# Altium schematic sheet pca63100_current_measurement.SchDoc: Power Profiler Kit II
size A3; Organization: Nordic Semiconductor; Revision: 1.0.1; SheetNumber: 4; SheetTotal: 6; CompanyName: Nordic Semiconductor; DocumentSize: A3
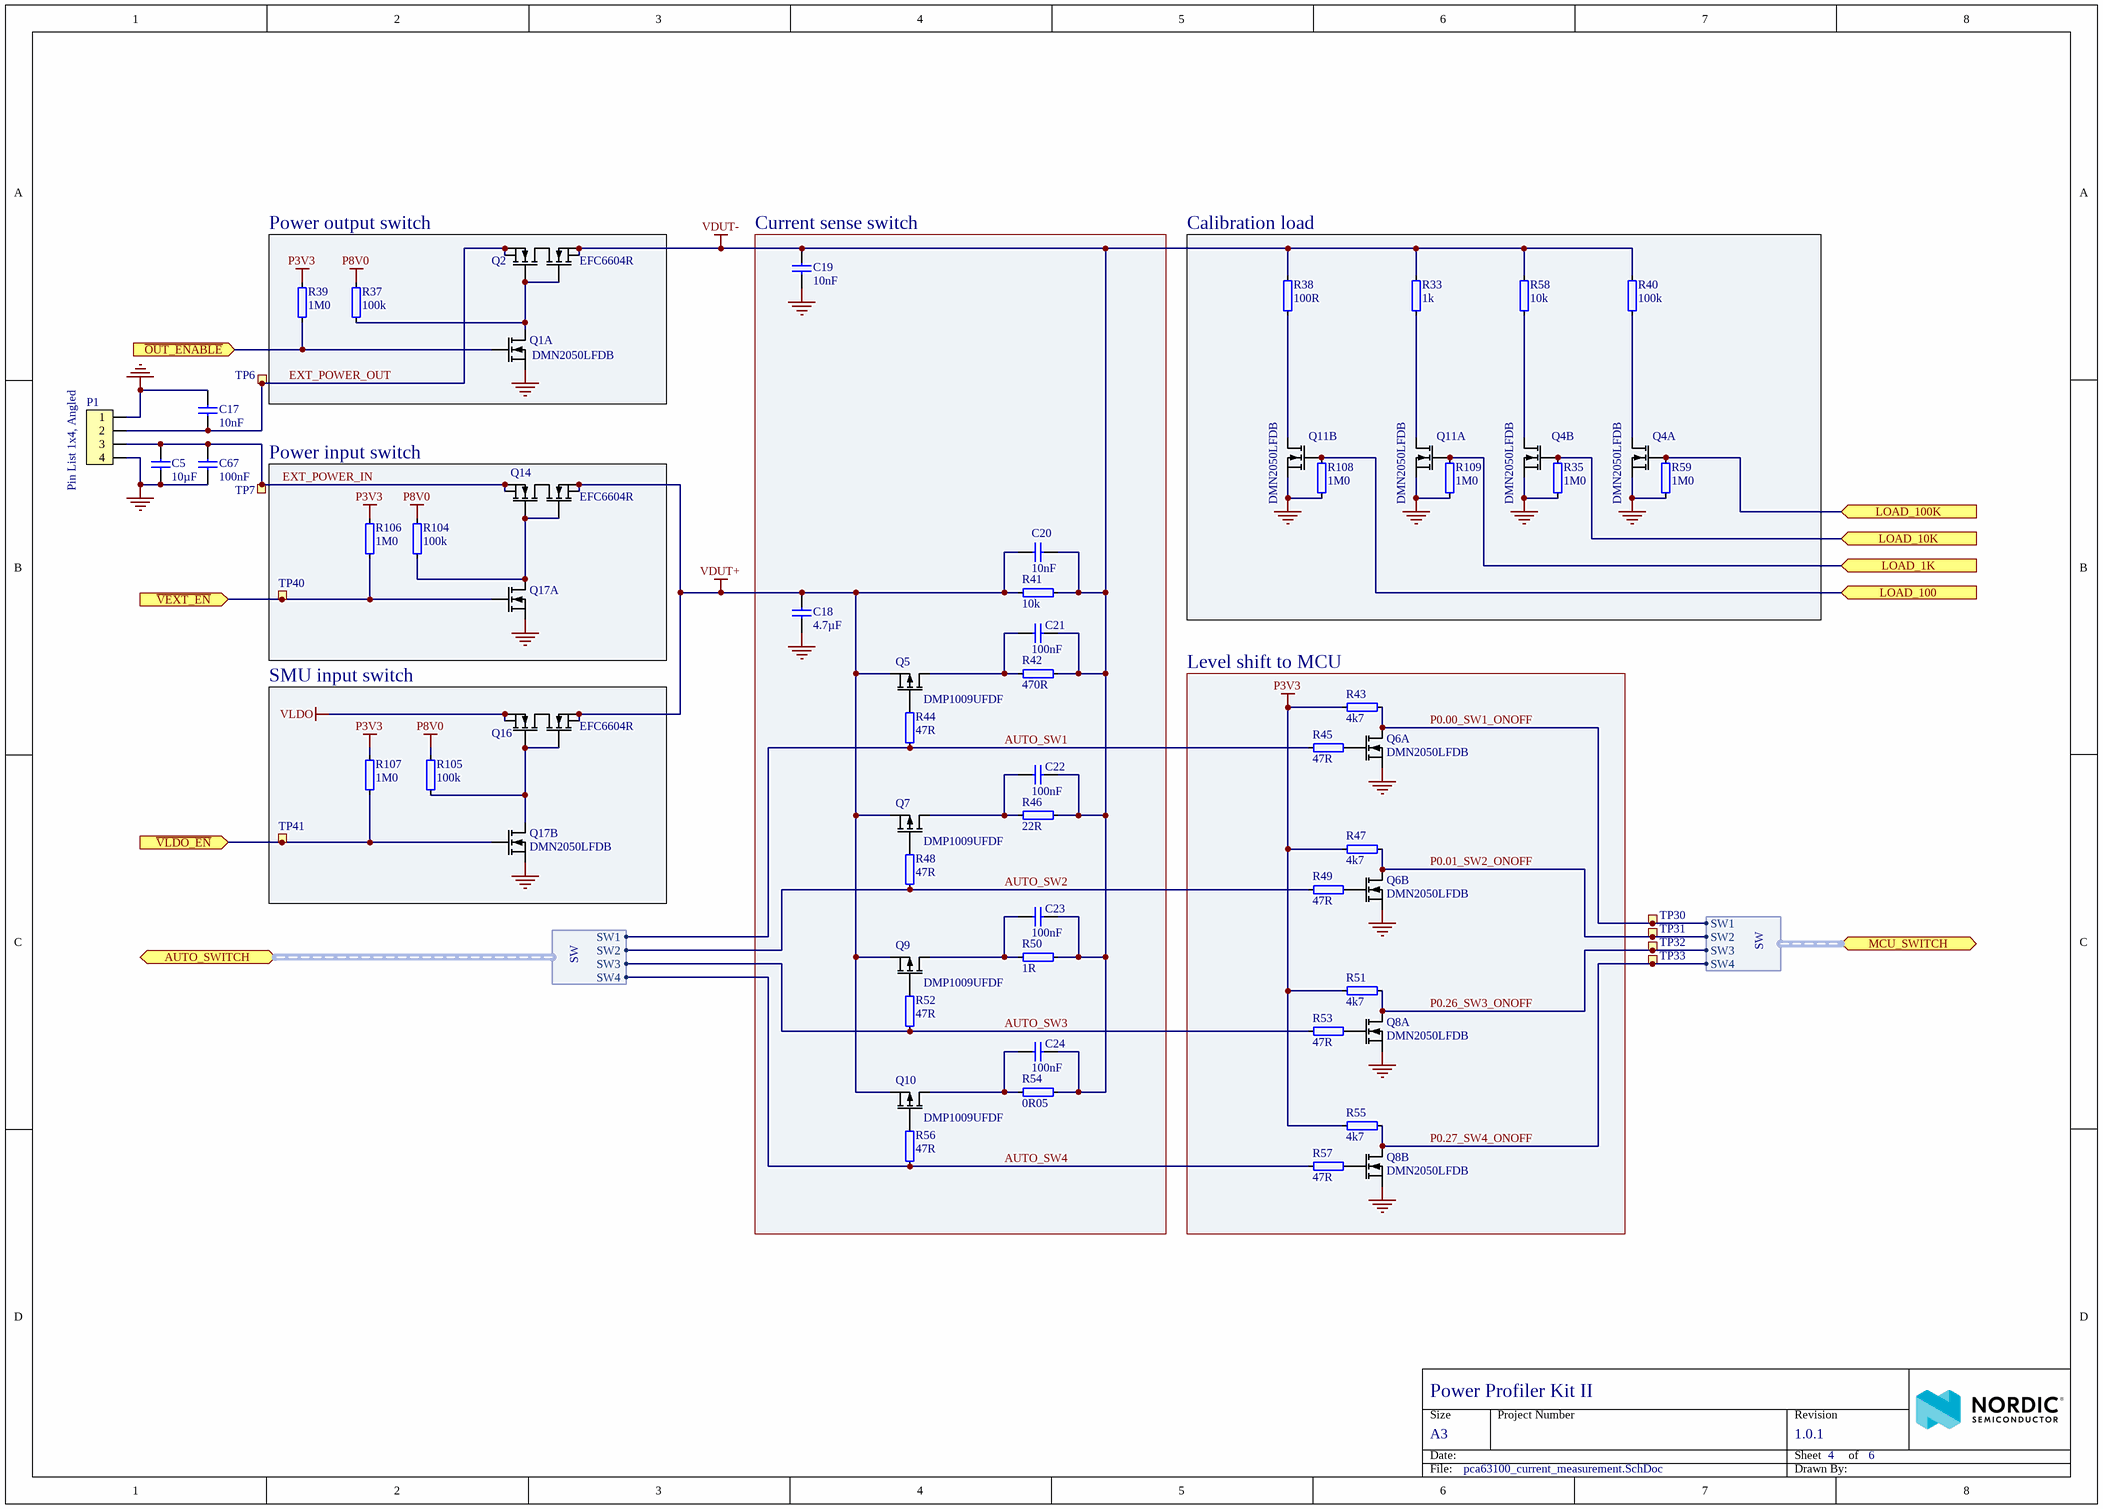
[diagram p0: pca63100_current_measurement.SchDoc]

## Parts
C5  10µF  [CAPC1608X06L]
C17  10nF  [CAPC0603X03L_C]
C18  4.7µF  [CAPC1005X04L]
C19  10nF  [CAPC0603X03L_C]
C20  10nF  [CAPC0603X03L_C]
C21  100nF  [CAPC0603X03L_C]
C22  100nF  [CAPC0603X03L_C]
C23  100nF  [CAPC0603X03L_C]
C24  100nF  [CAPC0603X03L_C]
C67  100nF  [CAPC0603X03L_C]
P1  Pin List 1x4, Angled  [LIST_ANG_1x4-SMD-2.54MM]
Q1  DMN2050LFDB  [DFN65P200X60_HS-6N]  (part A of 2)
Q2  EFC6604R  [BGA6C65P2X3_146X191X22]
Q4  DMN2050LFDB  [DFN65P200X60_HS-6N]  (parts A,B of 2)
Q5  DMP1009UFDF  [UDFN65P200X200X60_HS-6N]
Q6  DMN2050LFDB  [DFN65P200X60_HS-6N]  (parts A,B of 2)
Q7  DMP1009UFDF  [UDFN65P200X200X60_HS-6N]
Q8  DMN2050LFDB  [DFN65P200X60_HS-6N]  (parts A,B of 2)
Q9  DMP1009UFDF  [UDFN65P200X200X60_HS-6N]
Q10  DMP1009UFDF  [UDFN65P200X200X60_HS-6N]
Q11  DMN2050LFDB  [DFN65P200X60_HS-6N]  (parts A,B of 2)
Q14  EFC6604R  [BGA6C65P2X3_146X191X22]
Q16  EFC6604R  [BGA6C65P2X3_146X191X22]
Q17  DMN2050LFDB  [DFN65P200X60_HS-6N]  (value not drawn)  (parts A,B of 2)
R33  1k  [RESC1005X04L]
R35  1M0  [RESC0603X03L_C]
R37  100k  [RESC0603X03L_C]
R38  100R  [RESC2012X11L]
R39  1M0  [RESC0603X03L_C]
R40  100k  [RESC1005X04L]
R41  10k  [RESC1005X04L]
R42  470R  [RESC1005X04L]
R43  4k7  [RESC0603X03L_C]
R44  47R  [RESC0603X03L_C]
R45  47R  [RESC0603X03L_C]
R46  22R  [RESC1005X04L]
R47  4k7  [RESC0603X03L_C]
R48  47R  [RESC0603X03L_C]
R49  47R  [RESC0603X03L_C]
R50  1R  [RESC1005X04L]
R51  4k7  [RESC0603X03L_C]
R52  47R  [RESC0603X03L_C]
R53  47R  [RESC0603X03L_C]
R54  0R05  [RESC1005X04L]
R55  4k7  [RESC0603X03L_C]
R56  47R  [RESC0603X03L_C]
R57  47R  [RESC0603X03L_C]
R58  10k  [RESC0603X03L_C]
R59  1M0  [RESC0603X03L_C]
R104  100k  [RESC0603X03L_C]
R105  100k  [RESC0603X03L_C]
R106  1M0  [RESC0603X03L_C]
R107  1M0  [RESC0603X03L_C]
R108  1M0  [RESC0603X03L_C]
R109  1M0  [RESC0603X03L_C]
TP6  Ø1.5mm,SMD  [TP_SMD_Ø1.5mm]  (value not drawn)  (no BOM)
TP7  Ø1.5mm,SMD  [TP_SMD_Ø1.5mm]  (value not drawn)  (no BOM)
TP30  Ø0.7mm,SMD  [TP_SMD_Ø0.7mm]  (value not drawn)  (no BOM)
TP31  Ø0.7mm,SMD  [TP_SMD_Ø0.7mm]  (value not drawn)  (no BOM)
TP32  Ø0.7mm,SMD  [TP_SMD_Ø0.7mm]  (value not drawn)  (no BOM)
TP33  Ø0.7mm,SMD  [TP_SMD_Ø0.7mm]  (value not drawn)  (no BOM)
TP40  Ø0.7mm,SMD  [TP_SMD_Ø0.7mm]  (value not drawn)  (no BOM)
TP41  Ø0.7mm,SMD  [TP_SMD_Ø0.7mm]  (value not drawn)  (no BOM)

## Blocks framed on the sheet
Power output switch: Q1 Q2 R37 R39
Current sense switch: C18-C24 Q5 Q7 Q9 Q10 R41 R42 R44 R46 R48 R50 R52 R54 R56
Calibration load: Q4 Q11 R33 R35 R38 R40 R58 R59 R108 R109
Power input switch: Q14 Q17 R104 R106 TP40
SMU input switch: Q16 Q17 R105 R107 TP41
Level shift to MCU: Q6 Q8 R43 R45 R47 R49 R51 R53 R55 R57

## Ports
AUTO_SWITCH (bidir, harness SW), LOAD_1K (in), LOAD_10K (in), LOAD_100 (in), LOAD_100K (in), MCU_SWITCH (bidir, harness SW), ~{OUT_ENABLE} (in), ~{VEXT_EN} (in), ~{VLDO_EN} (in)

## Harnesses
SW: SW1, SW2, SW3, SW4

## Nets
GND: C5.2 C17.1 C18.2 C19.1 C67.2 P1.1 P1.4 Q1.1(S1) Q4.1(S1) Q4.4(S2) Q6.1(S1) Q6.4(S2) Q8.1(S1) Q8.4(S2) Q11.1(S1) Q11.4(S2) Q17.1(S1) Q17.4(S2) R35.1 R59.1 R108.1 R109.1
P3V3: R39.2 R43.2 R47.2 R51.2 R55.2 R106.2 R107.2
P8V0: R37.1 R104.2 R105.2
VDUT+: C18.1 C20.1 Q5.2(S) Q7.2(S) Q9.2(S) Q10.2(S) Q14.1(S1) Q14.3(S2) Q16.1(S1) Q16.3(S2) R41.1
VDUT-: C19.2 C20.2 C21.2 C22.2 C23.2 C24.2 Q2.1(S1) Q2.3(S2) R33.1 R38.2 R40.2 R41.2 R42.2 R46.2 R50.2 R54.1 R58.1
VLDO: Q16.4(S2) Q16.6(S2)
AUTO_SW1: R44.1 R45.2 ; port AUTO_SWITCH.SW1
AUTO_SW2: R48.1 R49.2 ; port AUTO_SWITCH.SW2
AUTO_SW3: R52.1 R53.2 ; port AUTO_SWITCH.SW3
AUTO_SW4: R56.1 R57.2 ; port AUTO_SWITCH.SW4
EXT_POWER_IN: C5.1 C67.1 P1.3 Q14.4(S2) Q14.6(S2) TP7.1
EXT_POWER_OUT: C17.2 P1.2 Q2.4(S2) Q2.6(S2) TP6.1
LOAD_1K: Q11.2(G1) R109.2 ; port LOAD_1K
LOAD_10K: Q4.5(G2) R35.2 ; port LOAD_10K
LOAD_100: Q11.5(G2) R108.2 ; port LOAD_100
LOAD_100K: Q4.2(G1) R59.2 ; port LOAD_100K
~{OUT_ENABLE}: Q1.2(G1) R39.1 ; port ~{OUT_ENABLE}
P0.00_SW1_ONOFF: Q6.6(D1) R43.1 TP30.1 ; port MCU_SWITCH.SW1
P0.01_SW2_ONOFF: Q6.3(D2) R47.1 TP31.1 ; port MCU_SWITCH.SW2
P0.26_SW3_ONOFF: Q8.6(D1) R51.1 TP32.1 ; port MCU_SWITCH.SW3
P0.27_SW4_ONOFF: Q8.3(D2) R55.1 TP33.1 ; port MCU_SWITCH.SW4
~{VEXT_EN}: Q17.2(G1) R106.1 TP40.1 ; port ~{VEXT_EN}
~{VLDO_EN}: Q17.5(G2) R107.1 TP41.1 ; port ~{VLDO_EN}
NetC21_1: C21.1 Q5.3(D) R42.1
NetC22_1: C22.1 Q7.3(D) R46.1
NetC23_1: C23.1 Q9.3(D) R50.1
NetC24_1: C24.1 Q10.3(D) R54.2
NetQ1_6: Q1.6(D1) Q2.2(G1) Q2.5(G2) R37.2
NetQ4_3: Q4.3(D2) R58.2
NetQ4_6: Q4.6(D1) R40.1
NetQ5_1: Q5.1(G) R44.2
NetQ6_2: Q6.2(G1) R45.1
NetQ6_5: Q6.5(G2) R49.1
NetQ7_1: Q7.1(G) R48.2
NetQ8_2: Q8.2(G1) R53.1
NetQ8_5: Q8.5(G2) R57.1
NetQ9_1: Q9.1(G) R52.2
NetQ10_1: Q10.1(G) R56.2
NetQ11_3: Q11.3(D2) R38.1
NetQ11_6: Q11.6(D1) R33.2
NetQ14_2: Q14.2(G1) Q14.5(G2) Q17.6(D1) R104.1
NetQ16_2: Q16.2(G1) Q16.5(G2) Q17.3(D2) R105.1

## Notes on the sheet
- Size
- Date:
- A3
- Project Number
- Sheet         of
- Revision
- File:
- Drawn By:

## Library data of the parts
C5 = 0603-10u-10V-X7T-GRM188: CAP CER 10UF 10V X7T 0603; Manufacturer: Murata; Manufacturer Part Number: GRM188D71A106MA73; Part number IPS: 00000004696; Note: 10VDC; Artikkelnr Noca: N.A; Pad Count: 2; Part Number: 0603-10u-10V-X7T-GRM188; ComponentLink1Description: Datasheet; ComponentLink2Description: Supplier link; HelpURL: https://no.mouser.com/datasheet/2/281/murata_03052018_GRM_Series_1-1310166.pdf; Footprint Doc: 0603; LatestRevisionDate: 2020-10-13; Pin Count: 2; Publisher: Nordic Semiconductor; Published: 2018-09-11; Value: 10µF; Supplier 1: Digi-Key; Supplier Part Number 1: 490-7200-1-ND; Supplier 2: Mouser; Supplier Part Number 2: 81-GRM188D71A106MA3D; Component Class: Capacitors; PartId: 100200414
C17 C19 C20 = C0201-10n: Capacitor, X7R, ±10%; Part number IPS: 00000003480; Note: 10V; Artikkelnr Noca: N.A.; Pad Count: 2; Part Number: C0201-10n; LatestRevisionDate: 2017-11-09; Pin Count: 2; Publisher: Nordic Semiconductor; Published: 2014-11-13; Value: 10nF; Footprint Doc: 0201; ComponentLink1Description: Datasheet; ComponentLink2Description: Supplier link; Component Class: Capacitors; PartId: 100200067
C18 = C0402-4µ7: Capacitor, X5R, ±20%; Part number IPS: 00000001251, 00000007165; Note: 10V; Artikkelnr Noca: 20039482; Pad Count: 2; Part Number: C0402-4µ7; LatestRevisionDate: 2017-11-09; Pin Count: 2; Publisher: Nordic Semiconductor; Published: 2009-05-08; Value: 4.7µF; Footprint Doc: 0402; ComponentLink1Description: Datasheet; ComponentLink2Description: Supplier link; Supplier 1: Digi-Key; Supplier Part Number 1: 490-13252-1-ND; Component Class: Capacitors; PartId: 100200193
C21-C24 C67 = C0201-100n: Capacitor, X5R, ±10%; Part number IPS: 00000001248, 00000002505; Note: 16V; Artikkelnr Noca: N.A.; Pad Count: 2; Part Number: C0201-100n; LatestRevisionDate: 2017-11-09; Pin Count: 2; Publisher: Nordic Semiconductor; Published: 2014-11-13; Value: 100nF; Footprint Doc: 0201; ComponentLink1Description: Datasheet; ComponentLink2Description: Supplier link; Component Class: Capacitors; PartId: 100200078
P1 = Pin List Ang 1x4 SMD, 2.54mm: Pin List 1x4, 2.54mm (100mil), Right Angled, SMD; Part number IPS: 00000004780; Artikkelnr Noca: N.A.; Pad Count: 4; Part Number: Pin List Ang 1x4 SMD, 2.54mm; Footprint Doc: LIST_ANG_1x4-SMD-2.54MM; LatestRevisionDate: 2020-04-29; Pin Count: 4; Publisher: Nordic Semiconductor; Published: 2015-01-23; Value: Pin List 1x4, Angled; ComponentLink1Description: Datasheet; ComponentLink2Description: Supplier link; Supplier 1: Cabcon; Supplier Part Number 1: 1125B-1104S0Z135CR02; Supplier 2: Samtec; Supplier Part Number 2: TSM-104-01-L-SH-A; Component Class: Connectors; PartId: 100500358
Q1 Q4 Q6 Q8 Q11 Q17 = DMN2050LFDB: Dual N Ch MOFET, 3.3A, 45mOhm @ 5A, 4.5V, 730mW; Manufacturer: Diodes Incorporated; Manufacturer Part Number: DMN2050LFDB-7; Part number IPS: 00000004782; Artikkelnr Noca: N.A.; Pad Count: 6; Part Number: DMN2050LFDB; Footprint Doc: DFN-6; LatestRevisionDate: 2020-04-30; Pin Count: 6; Publisher: Nordic Semiconductor; Published: 2020-04-30; Value: DMN2050LFDB; Supplier 1: Digi-Key; Supplier Part Number 1: DMN2050LFDB-7DICT-ND; Supplier 2: Mouser; Supplier Part Number 2: 621-DMN2050LFDB-7; ComponentLink1URL: https://www.diodes.com/assets/Datasheets/DMN2050LFDB.pdf; ComponentLink1Description: Datasheet; ComponentLink2Description: Supplier link; HelpURL: https://www.diodes.com/assets/Datasheets/DMN2050LFDB.pdf; Component Class: Semiconductors; PartId: 101300176
Q2 Q14 Q16 = EFC6604R: Dual MOSFET, Dual N Channel, 13 A, 12 V, 0.009 ohm, 4.5 V, 2.5 V; Manufacturer: ON Semiconductor; Manufacturer Part Number: EFC6604R-TR; Part number IPS: 00000004783; Artikkelnr Noca: N.A.; Pad Count: 6; Part Number: EFC6604R; ComponentLink1URL: https://www.onsemi.com/pub/Collateral/EFC6604R-D.PDF; ComponentLink1Description: Datasheet; ComponentLink2URL: https://www.digikey.no/products/en/discrete-semiconductor-products/transistors-fets-mosfets-arrays/289?k=EFC6604; ComponentLink2Description: Supplier link; HelpURL: https://www.onsemi.com/products/discretes-drivers/mosfets/efc6604r; Footprint Doc: WLCSP-6; LatestRevisionDate: 2019-10-01; Pin Count: 6; Publisher: Nordic Semiconductor; Published: 2019-10-01; Value: EFC6604R; Supplier 1: Mouser; Supplier Part Number 1: 863-EFC6604R-TR; Supplier 2: Digi-Key; Supplier Part Number 2: EFC6604R-TR-ND; Component Class: Semiconductors; PartId: 101300168
Q5 Q7 Q9 Q10 = DMP1009UFDF: P Ch MOFET, 11A, 30mOhm max, 2W; Manufacturer: Diodes Incorporated; Part number IPS: 00000004784; Artikkelnr Noca: N.A.; Pad Count: 6; Part Number: DMP1009UFDF; Manufacturer Part Number: DMP1009UFDF; ComponentLink1URL: https://www.diodes.com/assets/Datasheets/DMP1009UFDF.pdf; ComponentLink1Description: Datasheet; ComponentLink2Description: Supplier link; Footprint Doc: UDFN-6; LatestRevisionDate: 2019-02-12; Pin Count: 6; Publisher: Nordic Semiconductor; Published: 2019-02-12; Value: DMP1009UFDF; Supplier 1: Digi-Key; Supplier Part Number 1: DMP1009UFDF-7DICT-ND; Component Class: Semiconductors; PartId: 101300164
R33 R41 = R0402-1k0_0.1%: Resistor, ±0.1%, 0.063W; Part number IPS: 00000004790; Note: Chip Res 0.1%; Artikkelnr Noca: 27469397; Pad Count: 2; Part Number: R0402-1k0_0.1%; Footprint Doc: 0402; LatestRevisionDate: 2016-06-02; Pin Count: 2; Publisher: Nordic Semiconductor; Published: 2015-11-11; ComponentLink1Description: Datasheet; ComponentLink2Description: Supplier link; Component Class: Resistors; PartId: 100100172
  R33: Value: 1k
  R41: Value: 10k
R35 R39 R59 R106-R109 = R0201-1M0: Resistor, ±1%, 0.05W; Part number IPS: 00000001418; Note: Chip Res 1%; Artikkelnr Noca: N.A.; Pad Count: 2; Part Number: R0201-1M0; Footprint Doc: 0201; LatestRevisionDate: 2014-11-13; Pin Count: 2; Publisher: Nordic Semiconductor; Published: 2014-11-13; Value: 1M0; ComponentLink1Description: Datasheet; ComponentLink2Description: Supplier link; Component Class: Resistors; PartId: 100100093
R37 R104 R105 = R0201-100k: Resistor, ±1%, 0.05W; Part number IPS: 00000001419; Note: Chip Res 1%; Artikkelnr Noca: N.A.; Pad Count: 2; Part Number: R0201-100k; Footprint Doc: 0201; LatestRevisionDate: 2014-11-13; Pin Count: 2; Publisher: Nordic Semiconductor; Published: 2014-11-13; Value: 100k; ComponentLink1Description: Datasheet; ComponentLink2Description: Supplier link; Component Class: Resistors; PartId: 100100080
R38 = R0805-100: Resistor, ±1%, 0.125W; Part number IPS: 00000004791; Note: Chip Res 1%; Artikkelnr Noca: 27089049; Pad Count: 2; Part Number: R0805-100; ComponentLink1Description: Datasheet; ComponentLink2Description: Supplier link; Footprint Doc: 0805; LatestRevisionDate: 2013-06-04; Pin Count: 2; Publisher: Nordic Semiconductor; Published: 2009-05-08; Value: 100R; Component Class: Resistors; PartId: 100100394
R40 = R0402-100k_0.1%: Resistor, ±0.1%, 0.063W; Part number IPS: 00000004792; Note: Chip Res 1%; Artikkelnr Noca: N.A.; Pad Count: 2; Part Number: R0402-100k_0.1%; ComponentLink1Description: Datasheet; ComponentLink2Description: Supplier link; Footprint Doc: 0402; LatestRevisionDate: 2016-02-12; Pin Count: 2; Publisher: Nordic Semiconductor; Published: 2016-02-12; Value: 100k; Supplier 1: Digi-key; Supplier Part Number 1: P100KDCCT-ND; Component Class: Resistors; PartId: 100100240
R42 = R0402-110: Resistor, ±1%, 0.063W; Part number IPS: 00000004793; Note: Chip Res 1%; Artikkelnr Noca: N.A.; Pad Count: 2; Part Number: R0402-110; ComponentLink1Description: Datasheet; ComponentLink2Description: Supplier link; Footprint Doc: 0402; LatestRevisionDate: 2017-08-15; Pin Count: 2; Publisher: Nordic Semiconductor; Published: 2017-08-15; Value: 470R; Supplier 1: Digi-Key; Supplier Part Number 1: 541-110LCT-ND; Component Class: Resistors; PartId: 100100150
R43 R47 R51 R55 = R0201-4k7: Resistor, ±1%, 0.05W; Part number IPS: 00000001706; Note: Chip Res 1%; Artikkelnr Noca: N.A.; Pad Count: 2; Part Number: R0201-4k7; Footprint Doc: 0201; LatestRevisionDate: 2014-11-13; Pin Count: 2; Publisher: Nordic Semiconductor; Published: 2014-11-13; Value: 4k7; ComponentLink1Description: Datasheet; ComponentLink2Description: Supplier link; Component Class: Resistors; PartId: 100100061
R44 R45 R48 R49 R52 R53 R56 R57 = R0201-47R: Resistor, ±1%, 0.05W; Part number IPS: 00000004794; Note: Chip Res 1%; Artikkelnr Noca: N.A.; Pad Count: 2; Part Number: R0201-47R; ComponentLink1Description: Datasheet; ComponentLink2Description: Supplier link; Footprint Doc: 0201; LatestRevisionDate: 2014-11-13; Pin Count: 2; Publisher: Nordic Semiconductor; Published: 2014-11-13; Value: 47R; Component Class: Resistors; PartId: 100100022
R46 = R0402-11R: Resistor, ±1%, 0.063W; Part number IPS: 00000007807; Note: Chip Res 1%; Artikkelnr Noca: N.A.; Pad Count: 2; Part Number: R0402-11R; ComponentLink1Description: Datasheet; ComponentLink2Description: Supplier link; Footprint Doc: 0402; LatestRevisionDate: 2016-11-09; Pin Count: 2; Publisher: Nordic Semiconductor; Published: 2016-11-09; Value: 22R; Supplier 1: Farnell; Supplier Part Number 1: 214-0577; Component Class: Resistors; PartId: 100100127
R50 = R0402-1R0: Resistor, ±1%, 0.063W; Part number IPS: 00000004795; Note: Chip Res 1%; Artikkelnr Noca: 27049001; Pad Count: 2; Part Number: R0402-1R0; ComponentLink1Description: Datasheet; ComponentLink2Description: Supplier link; Footprint Doc: 0402; LatestRevisionDate: 2012-06-22; Pin Count: 2; Publisher: Nordic Semiconductor; Published: 2012-06-22; Value: 1R; Component Class: Resistors; PartId: 100100112
R54 = R0402-0R051: RES SMD 0.051 OHM 1% 1/4W 0402; Manufacturer: Panasonic; Manufacturer Part Number: ERJ-2BWFR051X; Part number IPS: 00000004796; Note: Chip Res 1%; Artikkelnr Noca: N.A.; Pad Count: 2; Part Number: R0402-0R051; ComponentLink1Description: Datasheet; ComponentLink2Description: Supplier link; Footprint Doc: 0402; LatestRevisionDate: 2009-04-15; Pin Count: 2; Publisher: Nordic Semiconductor; Published: 2009-04-15; Value: 0R05; Supplier 1: Digi-Key; Supplier Part Number 1: P.051ATCT-ND; Supplier 2: Mouser; Supplier Part Number 2: 667-ERJ-2BWFR051X; Component Class: Resistors; PartId: 100100110
R58 = R0201-10k_0.1%: Resistor, ±0.1%, 0.031W; Part number IPS: 00000004786; Note: Chip Res 0.1%; Artikkelnr Noca: N.A.; Pad Count: 2; Part Number: R0201-10k_0.1%; Footprint Doc: 0201; LatestRevisionDate: 2019-10-07; Pin Count: 2; Publisher: Nordic Semiconductor; Published: 2019-10-07; Value: 10k; ComponentLink1Description: Datasheet; ComponentLink2Description: Supplier link; Component Class: Resistors; PartId: 100100597
TP6 TP7 = TP_SMD_Ø1.5MM: 1.5mm circular SMD testpad; Manufacturer: Nordic Semiconductor; Artikkelnr Noca: N.A.; Pad Count: 1; Part Number: TP_SMD_Ø1.5MM; ComponentLink1Description: Datasheet; ComponentLink2Description: Supplier link; Footprint Doc: TP_SMD_Ø1.5mm; LatestRevisionDate: 2016-06-02; Pin Count: 1; Publisher: Nordic Semiconductor; Published: 2016-06-02; Value: Ø1.5mm,SMD; Part number IPS: N.A.; Component Class: Connectors; PartId: 100500477
TP30-TP33 TP40 TP41 = TP_SMD_Ø0.7MM: 0.7mm circular SMD testpad; Manufacturer: Nordic Semiconductor; Artikkelnr Noca: N.A.; Pad Count: 1; Part Number: TP_SMD_Ø0.7MM; ComponentLink1Description: Datasheet; ComponentLink2Description: Supplier link; Footprint Doc: TP_SMD_Ø0.7mm; LatestRevisionDate: 2017-12-14; Pin Count: 1; Publisher: Nordic Semiconductor; Published: 2017-12-14; Value: Ø0.7mm,SMD; Part number IPS: N.A.; Component Class: Connectors; PartId: 100500474